# Altium schematic sheet SCH_02_Instrumentation_Amplifier.SchDoc
size A4; SheetNumber: 6; SheetTotal: 9; SPICEModelCacheRQKHUQCM: <root> / <DocumentId>RQKHUQCM</DocumentId> / <CacheFrame Number="0"> / <Model Name="0603_885012006063_1nf" Kind="CKT"> / <Text>******* / .subckt 0603_885012006063_1nF 1 2 / Rser 1 3 0.040317449025 / Lser 2 4 4.45418718E-10 / C1 3 4 0.000000001 / Rpar 3 4 10000000000 / .ends 0603_885012006063_1nF</Text> / </Model> / <Model Name="0603_885012206093_47nf" Kind="CKT"> / <Text>******* / .subckt 0603_885012206093_47nF 1 2 / Rser 1 3 0.02723 / Lser 2 4 0.00000000027891 / C1 3 4 0.000000047 / Rpar 3 4 10000000000 / .ends 0603_885012206093_47nF</Text> / </Model> / <Model Name="0603_885012106012_4.7uf" Kind="CKT"> / <Text>******* / .subckt 0603_885012106012_4.7uF 1 2 / Rser 1 3 0.00455496693599 / Lser 2 4 5.03384516E-10 / C1 3 4 0.0000047 / Rpar 3 4 20000000 / .ends 0603_885012106012_4.7uF</Text> / </Model> / <Model Name="0603_885012206095_100nf" Kind="CKT"> / <Text>******* / .subckt 0603_885012206095_100nF 1 2 / Rser 1 3 0.0157659152881 / Lser 2 4 3.10171966E-10 / C1 3 4 0.0000001 / Rpar 3 4 5000000000 / .ends 0603_885012206095_100nF</Text> / </Model> / </CacheFrame> / </root>
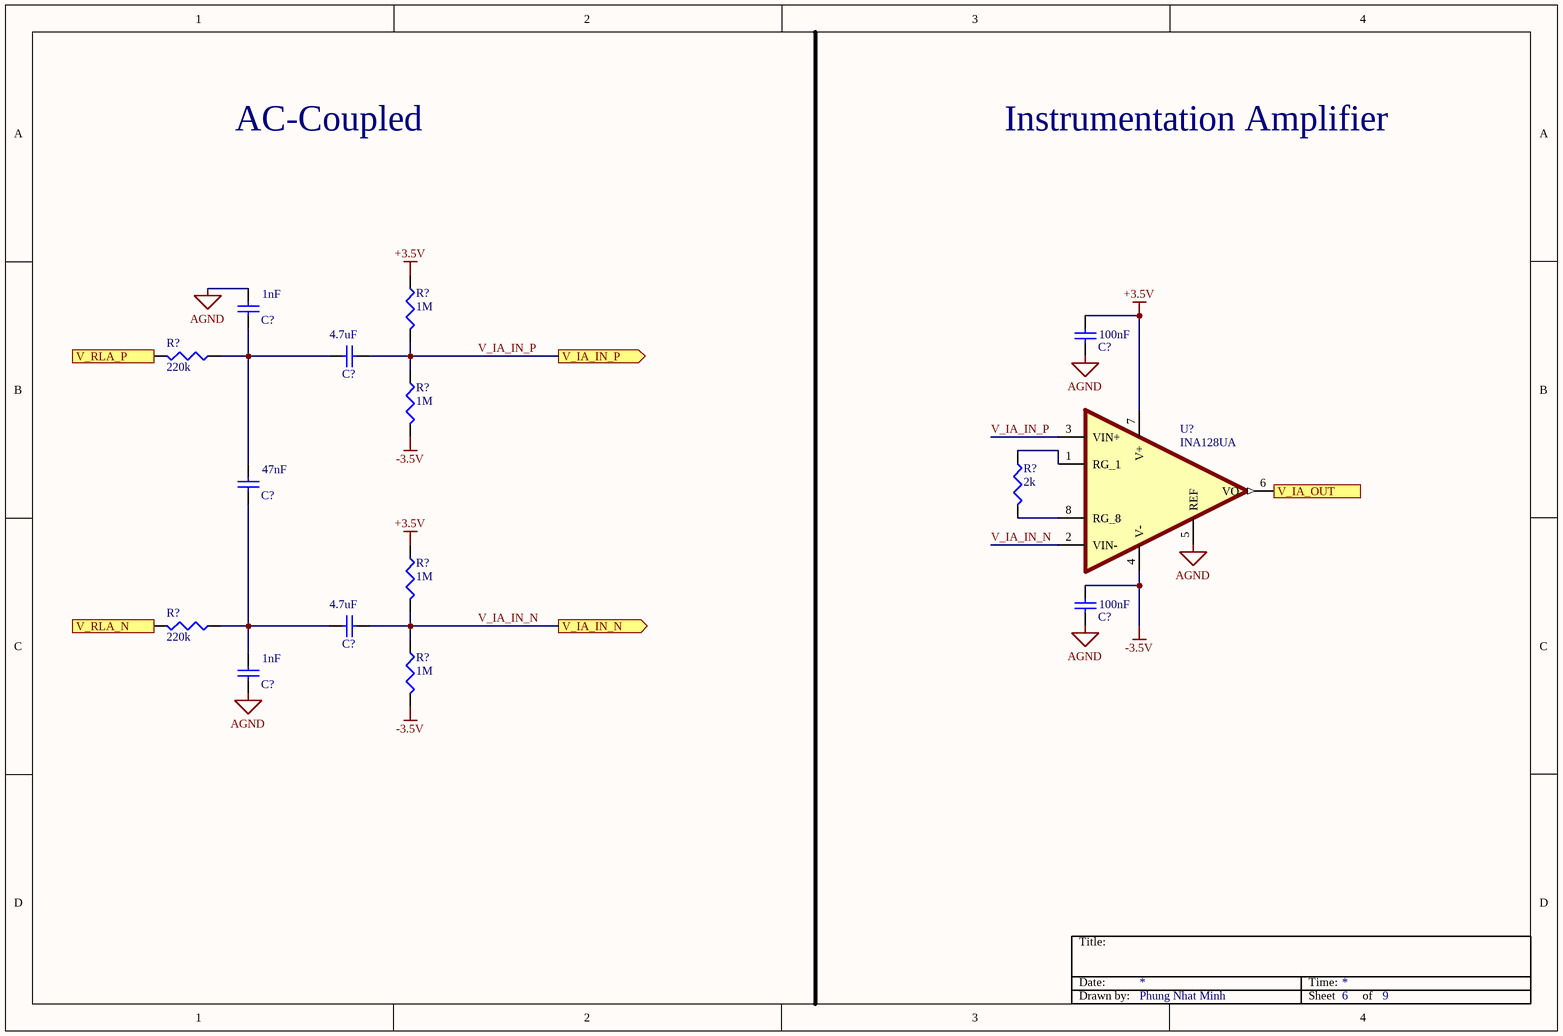
[diagram p0: SCH_02_Instrumentation_Amplifier.SchDoc]

## Parts
(Parts that share a designator on the sheet are numbered #1, #2 ... from top to bottom, then left to right.)
C?#1  1nF  [WCAP-CSGP_0603_L1.6W0.8H0.8_Reflow]
C?#2  4.7uF  [WCAP-CSGP_0603_L1.6W0.8H0.8_Reflow]
C?#3  100nF  [WCAP-CSGP_0603_L1.6W0.8H0.8_Reflow]
C?#4  47nF  [WCAP-CSGP_0603_L1.6W0.8H0.8_Reflow]
C?#5  4.7uF  [WCAP-CSGP_0603_L1.6W0.8H0.8_Reflow]
C?#6  100nF  [WCAP-CSGP_0603_L1.6W0.8H0.8_Reflow]
C?#7  1nF  [WCAP-CSGP_0603_L1.6W0.8H0.8_Reflow]
R?#1  1M  [WRIS-PSMB_0603_L1.6W0.8H0.35]
R?#2  220k  [WRIS-PSMB_0603_L1.6W0.8H0.35]
R?#3  1M  [WRIS-PSMB_0603_L1.6W0.8H0.35]
R?#4  2k  [WRIS-PSMB_0603_L1.6W0.8H0.35]
R?#5  1M  [WRIS-PSMB_0603_L1.6W0.8H0.35]
R?#6  220k  [WRIS-PSMB_0603_L1.6W0.8H0.35]
R?#7  1M  [WRIS-PSMB_0603_L1.6W0.8H0.35]
U?  INA128UA  [SOIC127P599X175-8N]

## Ports
V_IA_IN_N (out, see Schematic_Top[2B]), V_IA_IN_P (out, see Schematic_Top[2B]), V_IA_OUT (out, see Schematic_Top[2A]), V_RLA_N (in, see Schematic_Top[2B]), V_RLA_P (in, see Schematic_Top[2B])

## Nets
+3.5V: C?#3.2 R?#1.1 R?#5.1 U?.7(V+)
-3.5V: C?#6.2 R?#3.2 R?#7.2 U?.4(V-)
AGND: C?#1.2 C?#3.1 C?#6.1 C?#7.1 U?.5(REF)
V_IA_IN_N: C?#5.2 R?#5.2 R?#7.1 U?.2(VIN-) ; port V_IA_IN_N
V_IA_IN_P: C?#2.2 R?#1.2 R?#3.1 U?.3(VIN+) ; port V_IA_IN_P
V_IA_OUT: U?.6(VO) ; port V_IA_OUT
V_RLA_N: R?#6.2 ; port V_RLA_N
V_RLA_P: R?#2.2 ; port V_RLA_P
NetC?#1_1: C?#1.1 C?#2.1 C?#4.2 R?#2.1
NetC?#4_1: C?#4.1 C?#5.1 C?#7.2 R?#6.1
NetR?#4_1: R?#4.1 U?.1(RG_1)
NetR?#4_2: R?#4.2 U?.8(RG_8)

## Notes on the sheet
- AC-Coupled
- Instrumentation Amplifier
- Title:
- Date:
- Time:
- Drawn by:
- Phung Nhat Minh
- Sheet
- of

## Library data of the parts
C?#1 C?#7 = 885012006063: WCAP-CSGP Multilayer Ceramic Chip Capacitor, General Purpose, size 0603, NP0, 1nF, 50VDC; Manufacturer: Wurth Elektronik; Case/Size Code: 0603; Capacitance Tolerance: +/-5%; Insulation Resistance: 10GOhm; Q Factor: 1000; Rated Voltage (DC): 50V; Technical Reference: NP00603102J050DFCT10000; Manufacturer Part Number: 885012006063; Category: Multilayer Ceramic Chip Capacitors; Match Code: WCAP-CSGP; ComponentLink1Description: Website Link; ComponentLink1URL: https://www.we-online.com/redexpert/article/885012006063?ad; ComponentLink2Description: Datasheet Link; ComponentLink2URL: https://www.we-online.com/redexpert/spec/885012006063?ad; Mount: Surface Mount; Operating Temperature Max: 125°C; Operating Temperature Min: -55°C; Packaging: Tape and Reel; Length: 1.6mm; Width: 0.8mm; Height: 0.8mm; Capacitance: 1nF; Ceramic Type: NP0
C?#2 C?#5 = 885012106012: WCAP-CSGP Multilayer Ceramic Chip Capacitor, General Purpose, size 0603, X5R, 4.7uF, 10VDC; Manufacturer: Wurth Elektronik; Case/Size Code: 0603; Capacitance Tolerance: +/-20%; Dissipation Factor: 10%; Insulation Resistance: 0.02GOhm; Rated Voltage (DC): 10V; Technical Reference: X5R0603475M010DFCT10000; Manufacturer Part Number: 885012106012; Category: Multilayer Ceramic Chip Capacitors; Match Code: WCAP-CSGP; ComponentLink1Description: Website Link; ComponentLink1URL: https://www.we-online.com/redexpert/article/885012106012?ad; ComponentLink2Description: Datasheet Link; ComponentLink2URL: https://www.we-online.com/redexpert/spec/885012106012?ad; Mount: Surface Mount; Operating Temperature Max: 85°C; Operating Temperature Min: -55°C; Packaging: Tape and Reel; Length: 1.6mm; Width: 0.8mm; Height: 0.8mm; Capacitance: 4.7uF; Ceramic Type: X5R
C?#3 C?#6 = 885012206095: WCAP-CSGP Multilayer Ceramic Chip Capacitor, General Purpose, size 0603, X7R, 100nF, 50VDC; Manufacturer: Wurth Elektronik; Case/Size Code: 0603; Capacitance Tolerance: +/-10%; Dissipation Factor: 3%; Insulation Resistance: 5GOhm; Rated Voltage (DC): 50V; Technical Reference: X7R0603104K050DFCT10000; Manufacturer Part Number: 885012206095; Category: Multilayer Ceramic Chip Capacitors; Match Code: WCAP-CSGP; ComponentLink1Description: Website Link; ComponentLink1URL: https://www.we-online.com/redexpert/article/885012206095?ad; ComponentLink2Description: Datasheet Link; ComponentLink2URL: https://www.we-online.com/redexpert/spec/885012206095?ad; Mount: Surface Mount; Operating Temperature Max: 125°C; Operating Temperature Min: -55°C; Packaging: Tape and Reel; Length: 1.6mm; Width: 0.8mm; Height: 0.8mm; Capacitance: 100nF; Ceramic Type: X7R
C?#4 = 885012206093: WCAP-CSGP Multilayer Ceramic Chip Capacitor, General Purpose, size 0603, X7R, 47nF, 50VDC; Manufacturer: Wurth Elektronik; Case/Size Code: 0603; Capacitance Tolerance: +/-10%; Dissipation Factor: 3%; Insulation Resistance: 10GOhm; Rated Voltage (DC): 50V; Technical Reference: X7R0603473K050DFCT10000; Manufacturer Part Number: 885012206093; Category: Multilayer Ceramic Chip Capacitors; Match Code: WCAP-CSGP; ComponentLink1Description: Website Link; ComponentLink1URL: https://www.we-online.com/redexpert/article/885012206093?ad; ComponentLink2Description: Datasheet Link; ComponentLink2URL: https://www.we-online.com/redexpert/spec/885012206093?ad; Mount: Surface Mount; Operating Temperature Max: 125°C; Operating Temperature Min: -55°C; Packaging: Tape and Reel; Length: 1.6mm; Width: 0.8mm; Height: 0.8mm; Capacitance: 47nF; Ceramic Type: X7R
R?#1-R?#7 = 580060716001: WRIS-PSMB Metal Plate Resistor, SMT, size 0603, 0.33W, 5mΩ, +/-1%; Manufacturer: Wurth Elektronik; Case/Size Code: 0603; Rated Current: 8.12A; Technical Reference: MB0603R005F103KAATP0000; Temperature Coefficient of Resistance: +/-100ppm/°C; Manufacturer Part Number: 580060716001; Category: Metal Plate Resistors; Match Code: WRIS-PSMB; ComponentLink1Description: Website Link; ComponentLink1URL: https://www.we-online.com/redexpert/article/580060716001?ad; ComponentLink2Description: Datasheet Link; ComponentLink2URL: https://www.we-online.com/redexpert/spec/580060716001?ad; Mount: Surface Mount; Operating Temperature Max: 155°C; Operating Temperature Min: -55°C; Packaging: Tape and Reel; Length: 1.6mm; Width: 0.8mm; Height: 0.35mm; Rated Power: 0.33W; Resistance: 5mΩ; Resistance Tolerance: +/-1%
U? = INA128UA: Precision, 130-dB CMRR, 700-A, Low-Power, Instrumentation Amplifier 8-SOIC -40 to 125; MP: INA128UA/2K5; MF: Texas Instruments; Value: *; Package: SOIC-8 Texas Instruments; Availability: Good; SnapEDA_Link: https://www.snapeda.com/parts/INA128UA/2K5/Texas%20Instruments/view-part/1191532/?ref=snap; Price: None; Purchase-URL: https://pricing.snapeda.com/search/part/INA128UA/2K5/?ref=eda